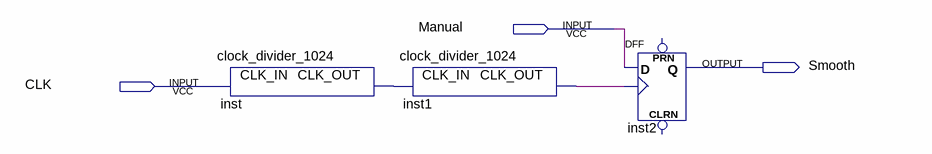
[diagram p0: schematic sheet]
// Quartus schematic lab11step2.bdf as structural Verilog: 3 symbols, 3 pins
module lab11step2 (
  input  Manual,
  input  CLK,
  output Smooth
);

  wire inst1_clk_out, inst_clk_out;

  clock_divider_1024 inst (.CLK_IN(CLK), .CLK_OUT(inst_clk_out));
  clock_divider_1024 inst1 (.CLK_IN(inst_clk_out), .CLK_OUT(inst1_clk_out));
  DFF inst2 (.CLK(inst1_clk_out), .D(Manual), .Q(Smooth));  // open: CLRN, PRN
endmodule
